# EAGLE design giraffe20_inverted (EAGLE 8.3.2)
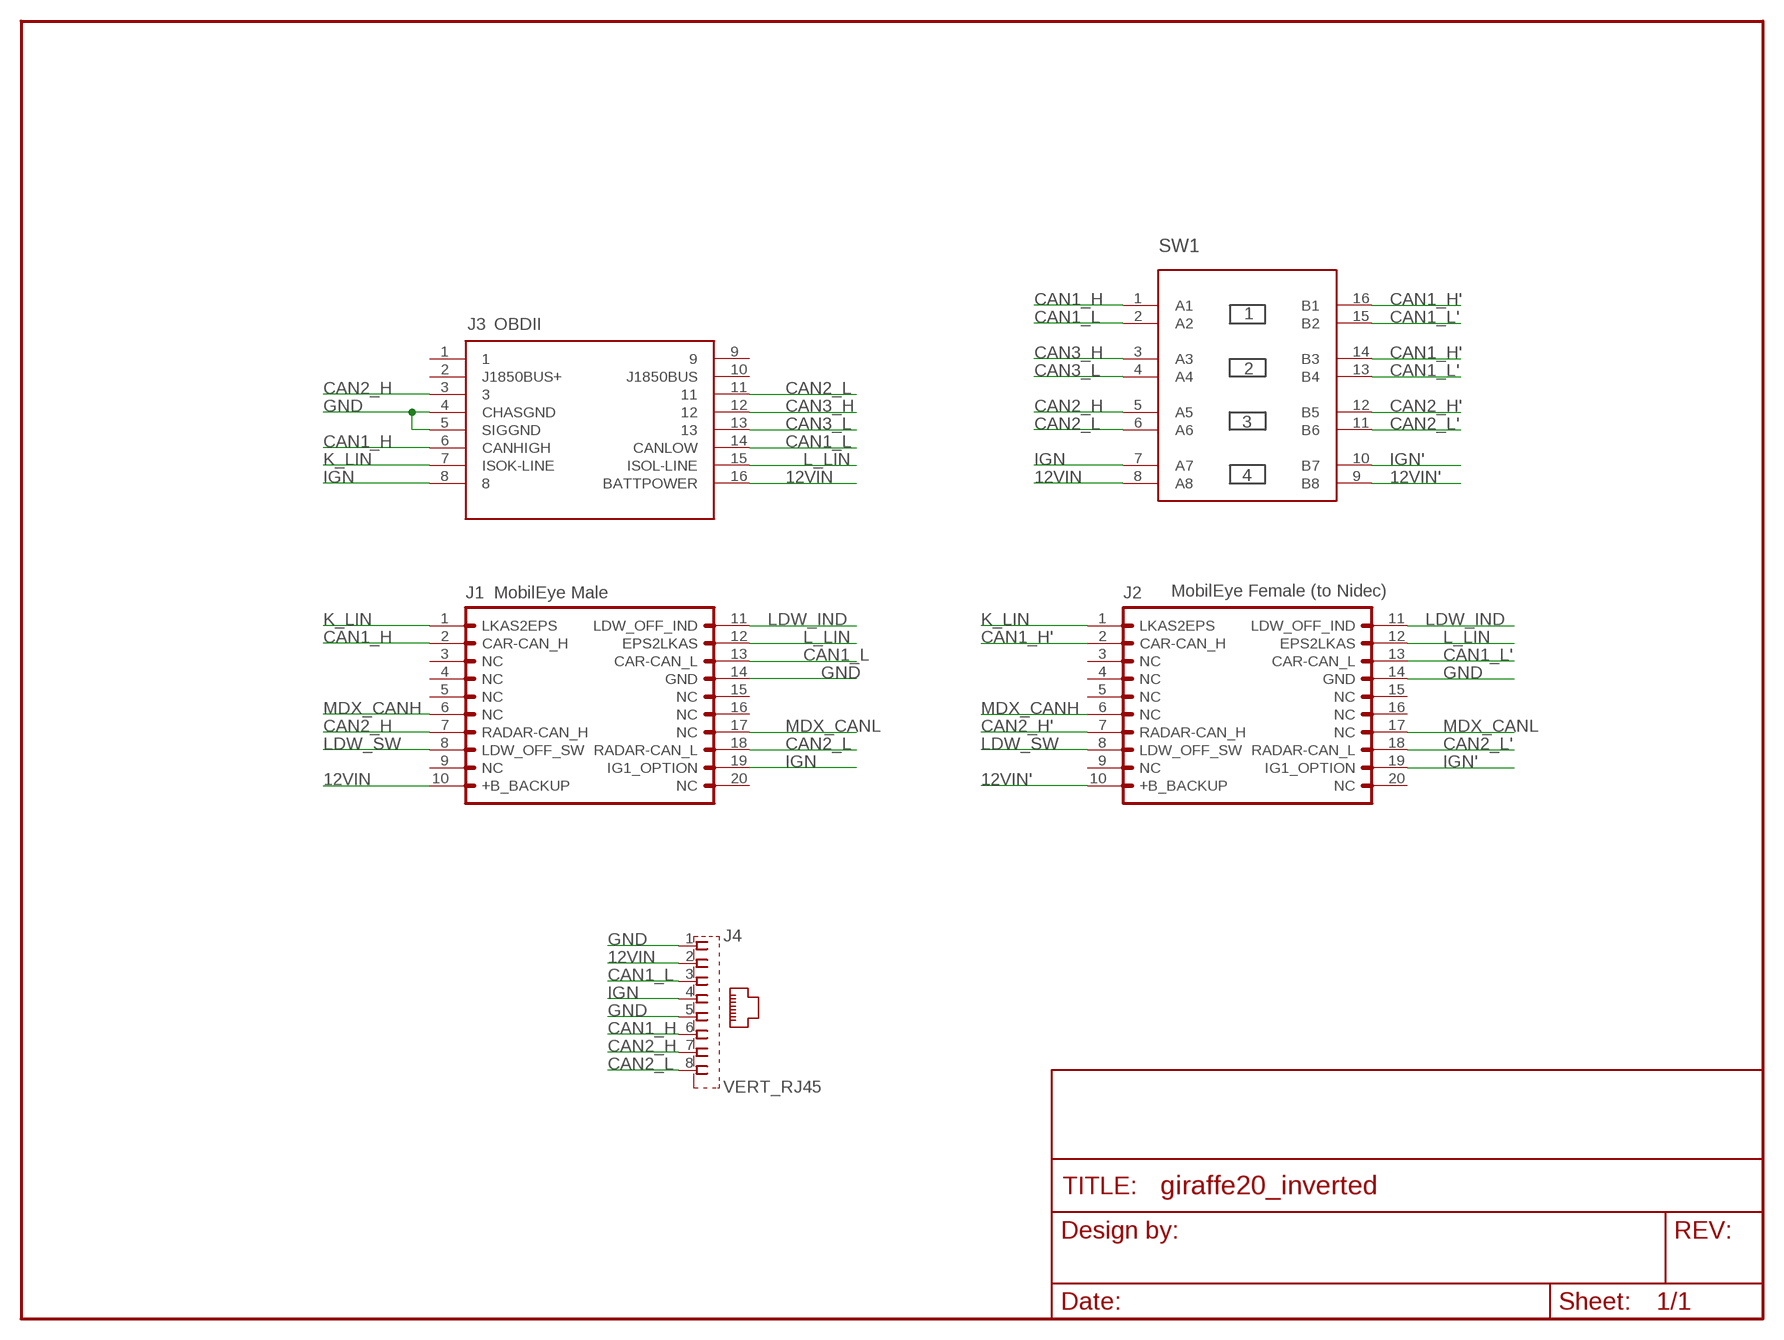
[diagram p0: schematic, sheet 1]

## Parts
FRAME1  FRAME-LETTERNO_PACKAGE  [DUMMY]
J1  MOBILEYERAMALE  [2X10(RA)]
J2  MOBILEYEFEMALE  [2X10(JAE_FEMALE)]
J3  OBDII-FEMALE-CUT  [OBDII-FEMALE-MIDCUT]
J4  VERT_RJ45  [GLX-S-88M]
SW1  4XDPSTSMT  [4-DPST]

## Nets
12VIN: J1.10(+B_BACKUP) J3.16(BATTPOWER) J4.2 SW1.8(A8)
12VIN': J2.10(+B_BACKUP) SW1.9(B8)
CAN1_H: J1.2(CAR-CAN_H) J3.6(CANHIGH) J4.6 SW1.1(A1)
CAN1_H': J2.2(CAR-CAN_H) SW1.14(B3) SW1.16(B1)
CAN1_L: J1.13(CAR-CAN_L) J3.14(CANLOW) J4.3 SW1.2(A2)
CAN1_L': J2.13(CAR-CAN_L) SW1.13(B4) SW1.15(B2)
CAN2_H: J1.7(RADAR-CAN_H) J3.3 J4.7 SW1.5(A5)
CAN2_H': J2.7(RADAR-CAN_H) SW1.12(B5)
CAN2_L: J1.18(RADAR-CAN_L) J3.11 J4.8 SW1.6(A6)
CAN2_L': J2.18(RADAR-CAN_L) SW1.11(B6)
CAN3_H: J3.12 SW1.3(A3)
CAN3_L: J3.13 SW1.4(A4)
GND: J1.14(GND) J2.14(GND) J3.4(CHASGND) J3.5(SIGGND) J4.1 J4.5
IGN: J1.19(IG1_OPTION) J3.8 J4.4 SW1.7(A7)
IGN': J2.19(IG1_OPTION) SW1.10(B7)
K_LIN: J1.1(LKAS2EPS) J2.1(LKAS2EPS) J3.7(ISOK-LINE)
L_LIN: J1.12(EPS2LKAS) J2.12(EPS2LKAS) J3.15(ISOL-LINE)
LDW_IND: J1.11(LDW_OFF_IND) J2.11(LDW_OFF_IND)
LDW_SW: J1.8(LDW_OFF_SW) J2.8(LDW_OFF_SW)
MDX_CANH: J1.6(NC) J2.6(NC)
MDX_CANL: J1.17(NC) J2.17(NC)
Unconnected: J1.3(NC) J1.4(NC) J1.5(NC) J1.9(NC) J1.15(NC) J1.16(NC) J1.20(NC) J2.3(NC) J2.4(NC) J2.5(NC) J2.9(NC) J2.15(NC) J2.16(NC) J2.20(NC) J3.1 J3.2(J1850BUS+) J3.9 J3.10(J1850BUS)

## Notes on the sheet
- OBDII
- MobilEye Male | MobilEye Female (to Nidec)

## Library data of the parts
FRAME1 = SparkFun-Aesthetics:FRAME-LETTER: Schematic Frame Standard 8.5x11 US Letter frame; DESIGNER: Nobody; VERSION: v01
J1 J2 = comma.ai:MOBILEYE: MobileEye connector for Acura ILX
J3 = comma.ai:OBDII-FEMALE
J4 = comma.ai:VERT_RJ45: Mod. Jack, Right Angle, 8 posiotion, 8 contatcs RJ45 Source: GLX-S-88M.pdf; OC_FARNELL: unknown; OC_NEWARK: unknown
SW1 = comma.ai:4XDPST

## Net classes
1 data: width 0.254 mm, clearance 0.254 mm

## Board
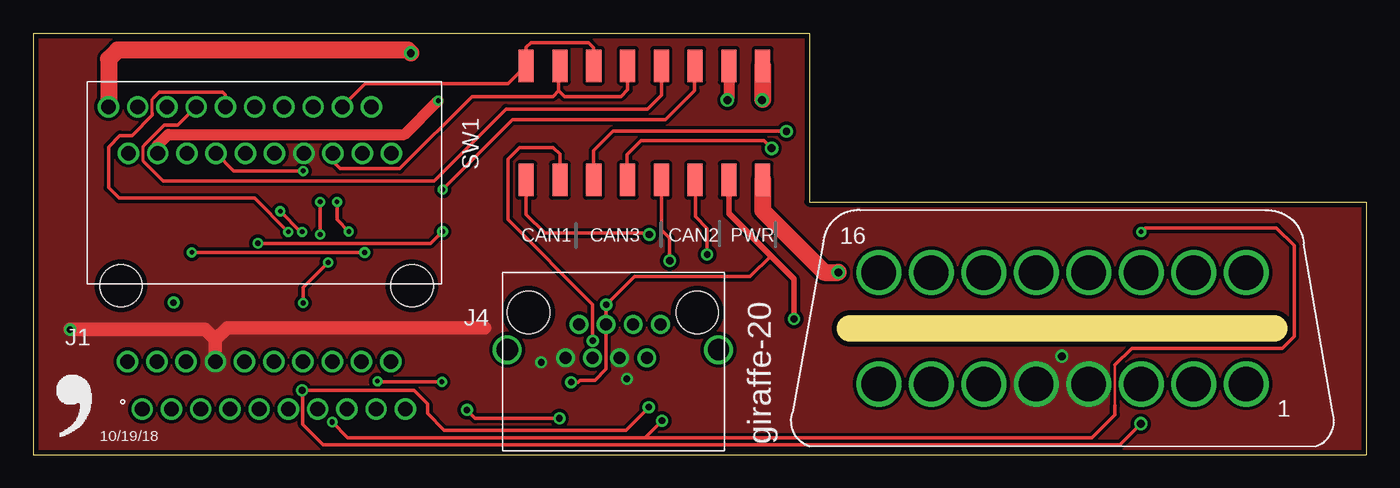
[diagram p1: board, top side]
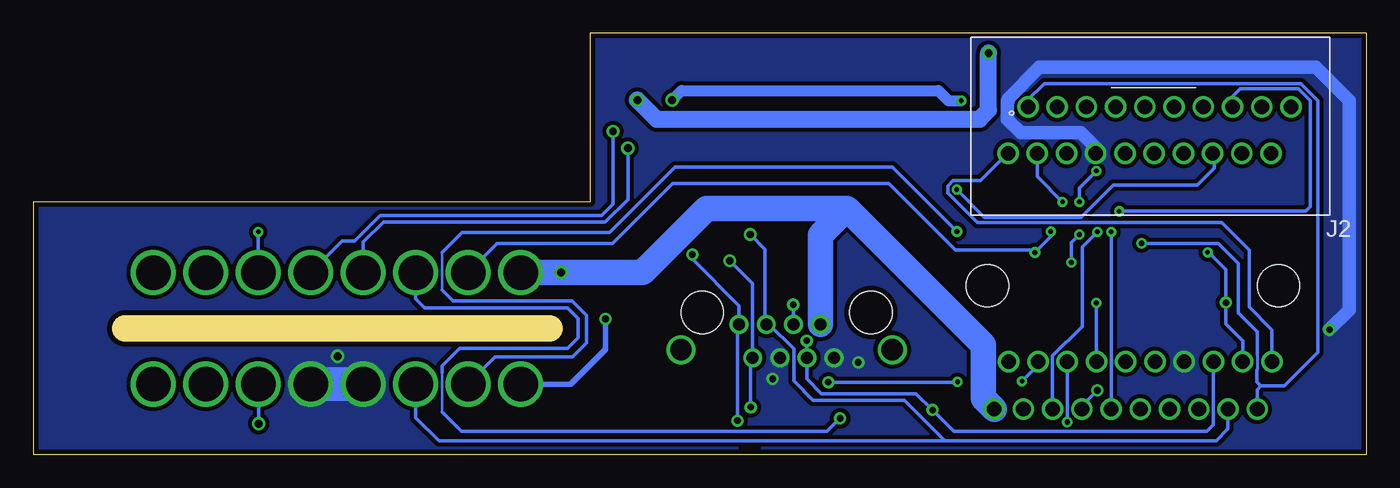
[diagram p2: board, bottom side, seen from below]

Size 100.33 x 31.75 mm. Coordinates in mm from the lower left corner, seen from the top.
Outline: 61.47,9.53 93.4,9.53
Outline: 0,31.75 58.42,31.75 58.42,19.05 100.33,19.05 100.33,0 0,0 0,31.75
Copper layers (1*16): Top 0.035559375mm / dielectric 1.6mm / Bottom 0.035559375mm
Design rules "oshpark-2layer *": minimum track width 6mil, minimum drill 10mil, track to track 6mil, track to pad 6mil, pad to pad 6mil, via to via 6mil, smd to smd 6mil, copper to edge 15mil, drill to drill 6mil, minimum pad ring 10mil, minimum via ring 8mil, stop-mask expansion 2.5mil, vias tented up to drill 0mil, thermal gap 10mil
bRestrict: area 46,0.2 to 46.8,0.6

### Footprints (pad centres in the part's own frame; a part is rotated, then mirrored left to right if it is on the bottom)
2X10(RA) = drill 1.1 pad 1.422: 1 9.83,1.83; 2 7.63,1.83; 3 5.43,1.83; 4 3.23,1.83; 5 1.03,1.83; 6 -1.17,1.83; 7 -3.37,1.83; 8 -5.57,1.83; 9 -7.77,1.83; 10 -9.97,1.83; 11 10.93,-1.77; 12 8.73,-1.77; 13 6.53,-1.77; 14 4.33,-1.77; 15 2.13,-1.77; 16 -0.07,-1.77; 17 -2.27,-1.77; 18 -4.47,-1.77; 19 -6.67,-1.77; 20 -8.87,-1.77 | hole 3.2: -10.47,-7.47; 11.43,-7.47
2X10(JAE_FEMALE) = drill 1.1 pad 1.422: 1 -8.7,1.75; 2 -6.5,1.75; 3 -4.3,1.75; 4 -2.1,1.75; 5 0.1,1.75; 6 2.3,1.75; 7 4.5,1.75; 8 6.7,1.75; 9 8.9,1.75; 10 11.1,1.75; 11 -10.2,-1.75; 12 -8,-1.75; 13 -5.8,-1.75; 14 -3.6,-1.75; 15 -1.4,-1.75; 16 0.8,-1.75; 17 3,-1.75; 18 5.2,-1.75; 19 7.4,-1.75; 20 9.6,-1.75
OBDII-FEMALE-MIDCUT = drill 2.6 pad 3.4: 1 13.825,-4.2; 2 9.875,-4.2; 3 5.925,-4.2; 4 1.975,-4.2; 5 -1.975,-4.2; 6 -5.925,-4.2; 7 -9.875,-4.2; 8 -13.825,-4.2; 9 13.825,4.2; 10 9.875,4.2; 11 5.925,4.2; 12 1.975,4.2; 13 -1.975,4.2; 14 -5.925,4.2; 15 -9.875,4.2; 16 -13.825,4.2
GLX-S-88M = drill 0.9 pad 1.422: 1 -3.66,1.57; 2 -2.64,4.11; 3 -1.62,1.57; 4 -0.6,4.11; 5 0.42,1.57; 6 1.44,4.11; 7 2.46,1.57; 8 3.48,4.11 | drill 1.6 pad 2.184: S1 -8.04,2.2; S2 7.86,2.2 | hole 3.2: -6.44,5; 6.26,5
4-DPST = smd 1.13 x 2.44: 1 -8.89,-4.3; 2 -6.35,-4.3; 3 -3.81,-4.3; 4 -1.27,-4.3; 5 1.27,-4.3; 6 3.81,-4.3; 7 6.35,-4.3; 8 8.89,-4.3; 9 8.89,4.3; 10 6.35,4.3; 11 3.81,4.3; 12 1.27,4.3; 13 -1.27,4.3; 14 -3.81,4.3; 15 -6.35,4.3; 16 -8.89,4.3

### Placement (x,y rotation side)
FRAME1  -1.27,-12.7 0 top  (outside the outline)
J1  18.03,5.26 180 top
J2  16.76,24.46 0 bottom
J3  77.47,9.53 0 top
J4  43.72,5.71 0 top
SW1  46,24.99 0 top
U$1  [LOGO]  1.12,1.04 0 top

### Tracks (layer width: path | path; a pad name or v marks a point on that pad's centre or on a via)
12VIN  (via drill 0.6)
  Top 1.27: SW1.8 54.89,18.4 59.55,13.74 v60.59,13.74
  Bottom 1.905: J3.16 63.63,13.74 v60.59,13.74 54.46,13.74 49.66,18.54 39.09,18.54 | J1.10 28.81,4.24 28.81,8.26 39.09,18.54 | 39.09,18.54 41.08,16.55 J4.2
12VIN'  (via drill 0.6)
  Top 0.813: 54.89,26.75 v54.86,26.72
  Top 1.27: SW1.9 54.89,26.75 | v28.42,30.25 28.19,30.48 6.35,30.48 5.66,29.79 J2.10
  Bottom 1.27: v54.86,26.72 53.42,25.27 29.11,25.27 28.42,25.96 v28.42,30.25
CAN1_H  (via drill 0.55)
  Top 0.254: SW1.1 37.11,18.08 38.51,16.69 46.25,16.69 v46.35,16.59
  Bottom 0.254: J1.2 10.4,1.94 11.3,1.04 31.71,1.04 | J3.6 71.55,5.32 71.55,2.79 69.8,1.04 31.71,1.04 | 45.24,13.14 45.24,9.9 J4.6 44.95,9.82 43.09,7.96 43.09,5.55 41.63,4.09 36.83,4.09 | 45.24,13.14 45.24,13.28 | 36.68,4.09 36.83,4.09 | 36.83,4.09 34.76,4.09 31.71,1.04 | v46.35,16.59 45.24,15.47 45.24,13.14
CAN1_H'
  Top 0.254: SW1.16 36.94,29.46 | SW1.14 42.19,30.66 41.81,31.04 37.47,31.04 37.11,30.68 SW1.16 | SW1.16 35.76,27.94 24.99,27.94 J2.2
CAN1_L  (via drill 0.5, 0.5 pad 0.55)
  Top 0.254: SW1.2 39.65,22.63 39.14,23.14 36.6,23.14 35.74,22.28 35.74,17.7 42.11,11.33 v42.11,8.59 | v32.64,3.38 33.27,2.74 v39.6,2.74
  Bottom 0.203: 69.55,6.13 69.55,4.52 69.55,4.51 69.55,3.23 | 69.55,6.13 69.55,6.14 | 69.55,6.13 69.55,6.17
  Bottom 0.254: J1.13 11.5,2.24 11.99,1.75 31.04,1.75 32.66,3.38 | J3.14 71.55,11.73 70.86,11.05 60.1,11.05 59.33,10.29 59.33,8.81 60.13,8.02 60.84,8.02 60.96,8.02 68.23,8.02 69.55,6.71 69.55,6.17 | v42.11,8.59 42.11,7.3 J4.3 42.11,7.27 42.11,5.71 41,4.6 33.88,4.6 32.66,3.38 | 69.55,3.23 68.07,1.75 40.59,1.75 v39.6,2.74 | v32.64,3.38 32.66,3.38
CAN1_L'
  Top 0.254: 39.55,27.41 39.12,26.98 33.02,26.98 27.58,21.54 23.09,21.54 22.56,22.06 J2.13 | 39.55,27.41 39.55,29.19 SW1.15 | SW1.13 44.73,27.48 44.22,26.98 39.98,26.98 39.55,27.41
CAN2_H  (via drill 0.5, 0.55, 0.6)
  Top 0.254: v83.36,2.34 81.79,0.76 21.82,0.76 20.3,2.29 20.3,4.8 v20.24,4.85 28.65,4.85 29.67,3.83 29.67,3.12 30.94,1.85 44.6,1.85 v46.33,3.58 | SW1.5 47.27,16.94 47.9,16.31 v47.9,14.61
  Bottom 0.254: v83.36,2.34 83.36,5.29 J3.3 | v20.24,4.85 21.4,3.69 J1.7 | v46.33,3.58 46.33,7.13 J4.7 46.2,7.31 46.2,12.9 v47.9,14.61 47.9,14.55
CAN2_H'
  Top 0.229: 8.31,22.1 8.27,22.13 8.27,23.21 8.4,23.34
  Top 0.254: SW1.12 47.27,27.08 46.23,26.04 35.59,26.04 30.18,20.62 9.78,20.62 8.31,22.1 | J2.7 10.87,24.82 9.88,24.82 8.4,23.34 8.28,23.22
CAN2_L  (via drill 0.35, 0.38, 0.5)
  Top 0.203: 81.41,3.73 81.41,6.76
  Top 0.254: v22.5,2.46 23.67,1.29 46.05,1.29 | 46.05,1.29 79.68,1.29 81.41,3.02 81.41,3.73 | v50.72,15.09 50.72,17.04 49.84,17.93 49.84,20.67 SW1.6 | v47.32,2.56 46.05,1.29 | 81.41,6.76 82.67,8.02 94.02,8.02 94.9,8.9 94.9,15.27 94.9,15.63 94.9,15.77 93.57,17.09 83.69,17.09 v83.39,16.79
  Bottom 0.203: J1.18
  Bottom 0.254: v22.5,2.46 J1.18 | v47.32,2.56 47.32,9.71 J4.8 47.2,11.21 50.72,14.73 v50.72,15.09 | v83.39,16.79 J3.11
CAN2_L'  (via drill 0.35)
  Top 0.254: SW1.11 49.78,27.43 47.6,25.25 36.09,25.25 v30.82,19.98
  Bottom 0.254: J2.18 11.43,22.58 11.43,21.59 12.7,20.32 19.05,20.32 21.49,17.88 28.73,17.88 v30.82,19.98
CAN3_H  (via drill 0.55)
  Top 0.254: SW1.3 42.19,22.91 43.64,24.36 v56.69,24.36
  Bottom 0.254: J3.12 77.07,16.1 76.15,16.1 74.22,18.03 57.56,18.03 56.69,18.9 v56.69,24.36
CAN3_L  (via drill 0.6)
  Top 0.254: v55.58,23.09 55.02,23.65 45.74,23.65 44.7,22.61 44.7,20.72 SW1.4
  Bottom 0.254: J3.13 75.49,16.01 73.97,17.53 57.28,17.53 55.58,19.23 v55.58,23.09
GND  (via drill 0.5, 0.5 pad 0.55, 0.6)
  Top 1.016: 13.7,8.68 J1.14 | 13.7,8.68 14.58,9.55 33.96,9.55 | 13.7,8.68 12.96,9.42 v2.77,9.42
  Bottom 1.016: J2.14 20.36,23.13 21.49,24.26 26.01,24.26 27,25.25 27,26.63 26.95,26.68 26.95,26.82 24.59,29.18 3.79,29.18 1.27,26.67 1.27,10.92 v2.77,9.42
  Bottom 2.54: J3.4 J3.5
  other vias: 38.23,6.96 44.68,5.71 77.42,7.42
  pour Top (isolate 0.254, no thermals): 0,31.75 0,0 100.33,0 100.33,19.05 58.42,19.05 58.42,31.75
  pour Bottom (isolate 0.305, no thermals): -0.05,31.8 58.42,31.8 58.42,19 100.3,19 100.3,0 -0.05,0
IGN  (via drill 0.35, 0.5, 0.5 pad 0.55)
  Top 0.254: v40.49,5.46 41.02,5.46 41.17,5.61 42.29,5.61 43.13,6.45 v43.13,11.3 45.24,13.41 53.95,13.41 55.53,14.98 | v30.76,5.49 25.96,5.49 v25.91,5.54
  Top 0.406: SW1.7 52.35,18.16 55.53,14.98 57.25,13.26 v57.25,10.24
  Bottom 0.254: v43.13,11.3 v43.12,11.29 J4.4 | v40.49,5.46 30.79,5.46 v30.76,5.49 | v25.91,5.54 24.7,6.74 J1.19
  Bottom 0.406: J3.8 63.63,5.31 59.89,5.31 57.25,7.95 v57.25,10.24
IGN'  (via drill 0.35, 0.6)
  Top 0.813: SW1.10 52.35,26.82 v52.25,26.72 | J2.19 9.36,23.33 10.16,24.13 27.94,24.13 v30.48,26.67
  Bottom 0.813: v52.25,26.72 51.54,27.43 32.21,27.43 31.45,26.67 v30.48,26.67
K_LIN  (via drill 0.4)
  Top 0.254: v30.81,16.82 30.49,16.5 30.1,16.1 29.92,15.93 v16.92,15.93
  Bottom 0.203: 69.55,15.24 69.55,14.54 69.55,14.53 69.55,12.39
  Bottom 0.229: 8.2,7.49 8.2,6.43 8.23,6.4
  Bottom 0.254: 69.55,15.24 68.05,16.74 56.97,16.74 52.05,21.67 35.66,21.67 v30.81,16.82 | 69.55,12.39 68.74,11.58 59.77,11.58 58.67,10.49 58.67,8.43 59.74,7.37 65.55,7.37 J3.7 | v16.92,15.93 11.14,15.93 9.63,14.41 9.63,10.69 8.2,9.27 8.2,7.49 | 8.23,6.4 8.23,5.49 7.92,5.18 | 7.92,5.18 6.17,5.18 3.63,7.72 3.63,26.66 4.94,27.96 24.23,27.96 25.46,26.73 J2.1 | 7.92,5.18 8.2,4.9 J1.1
L_LIN  (via drill 0.35, 0.4, 0.5)
  Top 0.254: v24.94,15.24 v11.94,15.24 | v22.86,19.05 22.86,17.71 v23.75,16.82
  Bottom 0.254: J3.15 65.42,15.9 56.72,15.9 52.2,20.42 35.94,20.42 30.94,15.42 25.12,15.42 v24.94,15.24 23.75,16.43 v23.75,16.82 | J1.12 9.3,8.59 10.57,9.86 v10.57,11.46 10.57,13.97 11.84,15.24 v11.94,15.24 | J2.12 24.76,20.95 v22.86,19.05
LDW_IND
  Bottom 0.254: J1.11 7.1,9.41 8.81,11.12 8.81,15.42 10.87,17.48 29.25,17.48 31.48,19.7 31.48,20.25 31.09,20.64 29.04,20.64 J2.11
LDW_SW  (via drill 0.35)
  Top 0.254: v18.59,18.34 20.14,16.79 v20.24,16.79
  Bottom 0.254: 20.3,16.79 v20.24,16.79 21.39,15.64 21.39,9.68 23.62,7.44 23.62,3.44 J1.8 | v18.59,18.34 4.57,18.34 4.22,18.69 4.22,26.67 5.11,27.56 9.5,27.56 10.06,27 J2.8
MDX_CANH  (via drill 0.35)
  Top 0.229: 8.96,25.75 8.96,26.8 9.07,26.9
  Top 0.254: v19.2,16.79 16.67,19.32 6.47,19.32 5.66,20.12 5.66,23.19 6.53,24.05 7.44,24.05 8.96,25.58 8.96,25.75 | 9.07,26.9 9.48,27.32 12.7,27.32 12.72,27.32 14.27,27.32 14.46,27.12 J2.6
  Bottom 0.254: v19.2,16.79 J1.6
MDX_CANL  (via drill 0.35)
  Top 0.254: J2.17 15.1,21.38 v20.32,21.38 | v21.59,19.05 v21.59,16.58 | v20.32,11.43 20.32,12.6 v22.2,14.48
  Bottom 0.254: v20.32,11.43 20.32,7.04 J1.17 | v21.59,19.05 21.59,20.11 v20.32,21.38 | v22.2,14.48 22.2,15.97 v21.59,16.58

### Text on the board
tPlace: CAN1 | CAN3 | CAN2 | PWR | 10/19/18 | giraffe-20
Document: *compatible with freeTheC pins soldered on TOP